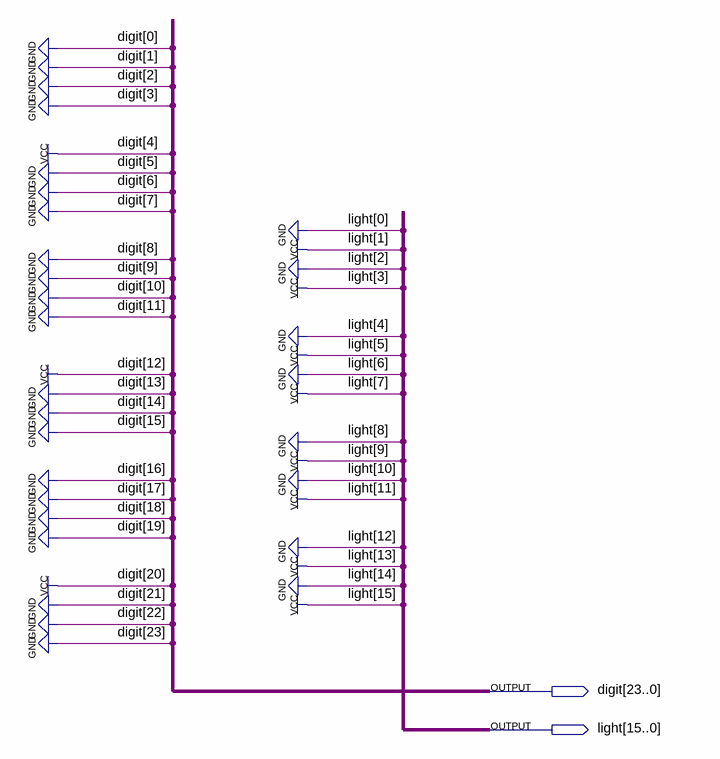
[diagram p0: schematic sheet]
// Quartus schematic Pattern_3_Frame_1.bdf as structural Verilog: 0 symbols, 2 pins
module Pattern_3_Frame_1 (
  output [23:0] digit,
  output [15:0] light
);


  assign digit = 24'b000100000001000000010000;
  assign light = 16'b1010101010101010;
endmodule
